# Altium project USB下载线mega8贴片.PrjPCB
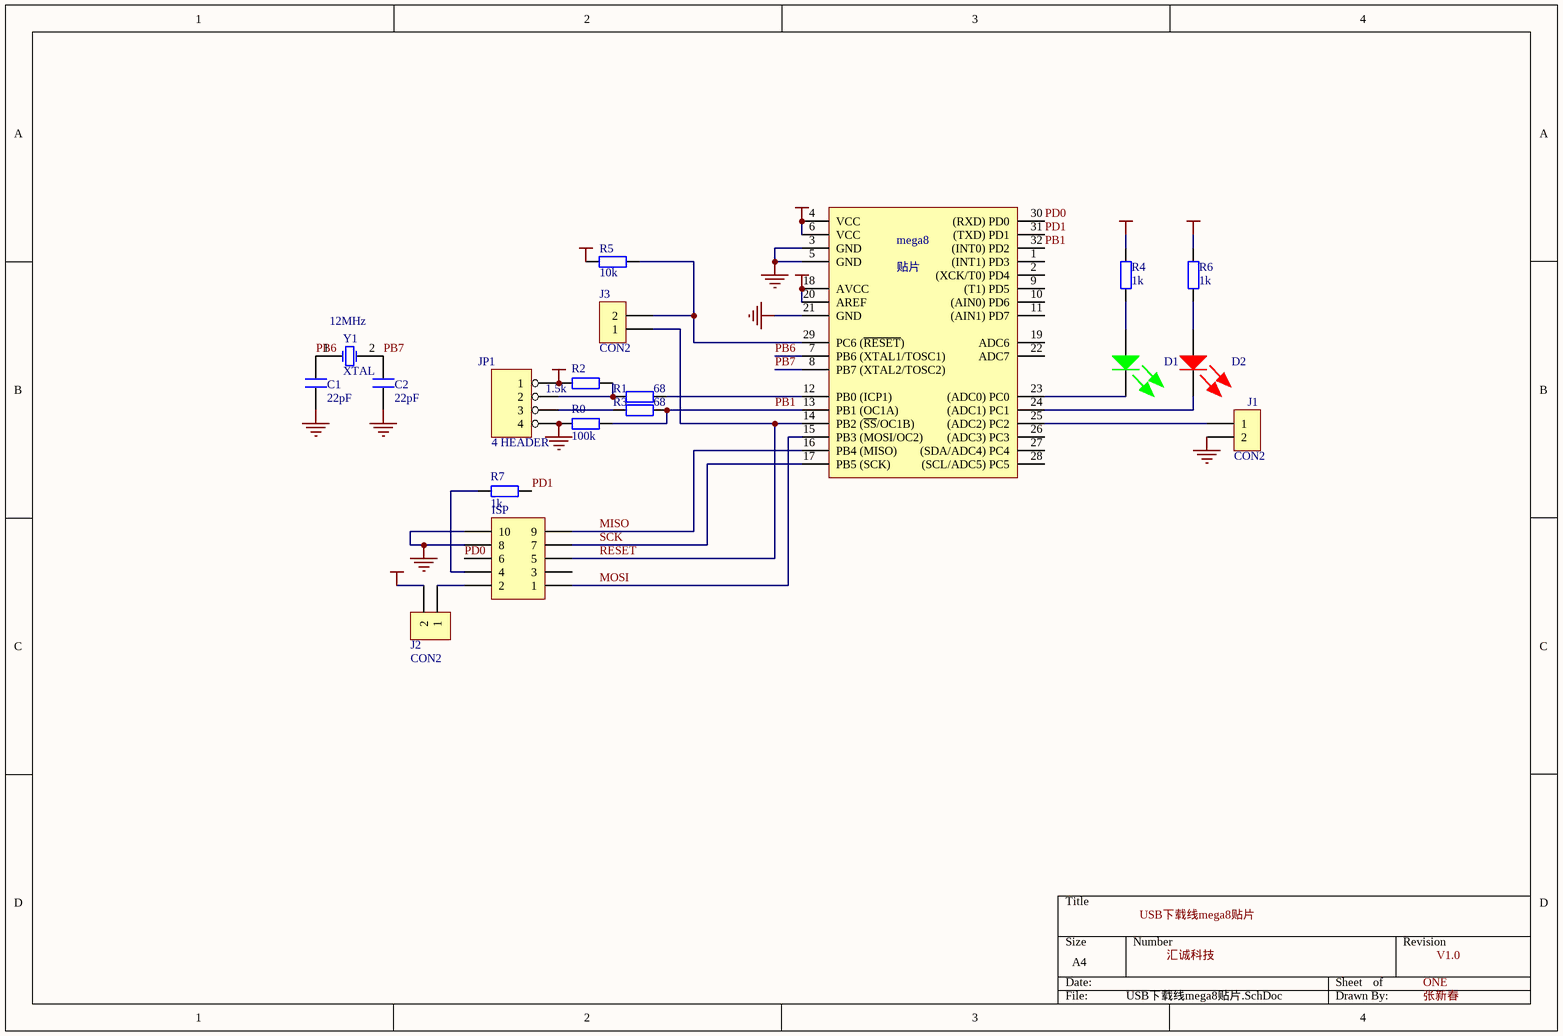
[diagram p0: USB下载线mega8贴片.SchDoc]
1 sheet, 19 parts. Net scope: global (net labels, ports and power ports of the same name join across sheets).
Board file: USB下载线mega8贴片.PcbDoc

## Sheet USB下载线mega8贴片.SchDoc
size A4

### Parts
C1  value 22pF  [HDR1X2]
C2  value 22pF  [HDR1X2]
D1  (no value)  [HDR1X2]
D2  (no value)  [HDR1X2]
ISP  (no value)  [HDR2X5]
J1  CON2  [HDR1X2]
J2  CON2  [HDR1X2]
J3  CON2  [HDR1X2]
JP1  4 HEADER  [USB]
mega8  贴片  [TQFP-32_0.8/7×7mm]
R0  value 100k  [HDR1X2]
R1  value 68  [HDR1X2]
R2  value 1.5k  [HDR1X2]
R3  value 68  [HDR1X2]
R4  value 1k  [HDR1X2]
R5  value 10k  [HDR1X2]
R6  value 1k  [HDR1X2]
R7  value 1k  [HDR1X2]
Y1  XTAL  value 12MHz  [SPST-2]

### Nets
GND: C1.1 C2.1 ISP.8 ISP.10 J1.2 JP1.4 mega8.3(GND) mega8.5(GND) mega8.21(GND) R0.1
VCC: J2.2 JP1.1 mega8.4(VCC) mega8.6(VCC) mega8.18(AVCC) mega8.20(AREF) R2.2 R4.2 R5.2 R6.2
MISO: ISP.9 mega8.16(PB4_(MISO))
MOSI: ISP.1 mega8.15(PB3_(MOSI/OC2))
PB1: mega8.13(PB1_(OC1A)) mega8.32((INT0)_PD2) R0.2 R3.1
PB6: C1.2 mega8.7(PB6_(XTAL1/TOSC1)) Y1.1(OSC1)
PB7: C2.2 mega8.8(PB7_(XTAL2/TOSC2)) Y1.2(OSC2)
PD0: ISP.6 mega8.30((RXD)_PD0)
PD1: mega8.31((TXD)_PD1) R7.2
RESET: ISP.5 J3.1 mega8.14(PB2_(~{SS}/OC1B))
SCK: ISP.7 mega8.17(PB5_(SCK))
NetD1_1: D1.1 R4.1
NetD1_2: D1.2 mega8.23((ADC0)_PC0)
NetD2_1: D2.1 R6.1
NetD2_2: D2.2 mega8.24((ADC1)_PC1)
NetISP_2: ISP.2 J2.1
NetISP_4: ISP.4 R7.1
NetJ1_1: J1.1 mega8.25((ADC2)_PC2)
NetJ3_2: J3.2 mega8.29(PC6_(~{RESET})) R5.1
NetJP1_2: JP1.2 R1.1 R2.1
NetJP1_3: JP1.3 R3.2
Netmega8_12: mega8.12(PB0_(ICP1)) R1.2

Not connected (* = marked no-connect by the designer): ISP 3; mega8 1((INT1)_PD3) 2((XCK/T0)_PD4) 9((T1)_PD5) 10((AIN0)_PD6) 11((AIN1)_PD7) 19(ADC6) 22(ADC7) 26((ADC3)_PC3) 27((SDA/ADC4)_PC4) 28((SCL/ADC5)_PC5)

### Notes on the sheet
- Labels drawn without touching a wire or pin: ONE, USB下载线mega8贴片, V1.0, 张新春, 汇诚科技

### Library data of the parts
C1 C2 = CAPSMD: Capacitor SMD1206; Bolt: RET; Kód: 93-00-19
D1 = LED Zöld: Zöld Led 3mm; Bolt: RET; Kód: 46-01-42; Value: Zöld
D2 = LED Piros: Piros Led 3mm; Bolt: RET; Kód: 46-01-40; Value: Piros
ISP = MLW10A: Header, 5-Pin, Dual row, Right Angle; Manufacturer: Generic Components; Class: Connector; Bolt: RET; Kód: 53-02-64
J1-J3 = CON2: Connector
JP1 = 4 HEADER: 4 Pin Header
mega8 = ATmega8-A: 8 位微处理器/32引脚; 子类别: 微处理器; 发布者: 磊元工作室; 发布日期: 2003年8月18日; 制造商: Atmel Corporation; 类别: 集成电路; 元件名称（国标）: 8 位微处理器; 元件名称（英文）: 8-bit Microcontroller; 特性:存储器容量: Flash：8KB ，EEPROM：512B ，RAM：1KB; 特性:定时器/计数器: 2 个 8-bit ，1 个 16-bit; 特性:模/数转换器: 8 通道 10-bit ADC; 特性:指令: 两个时钟周期的硬件乘法器
R0-R7 = RES: Resistor SMD1206, 1% fémréteg; Bolt: RET; Kód: 96-00-73
Y1 = XTAL: Crystal Oscillator; Manufacturer: Generic Components; Bolt: RET; Published: 08/06/2000; Publisher: Altium Hobart Technology Centre; Class: Oscillator; SubClass: Crystal Oscillator; Kód: 62-00-45